# EAGLE design keyboard (EAGLE 9.6.2)
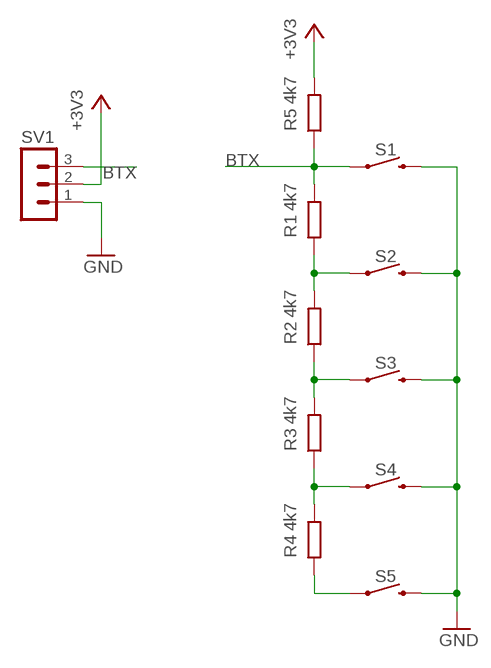
[diagram p0: schematic, sheet 1]

## Parts
R1  4k7  R-EU_R1206  [R1206]
R2  4k7  R-EU_R1206  [R1206]
R3  4k7  R-EU_R1206  [R1206]
R4  4k7  R-EU_R1206  [R1206]
R5  4k7  R-EU_R1206  [R1206]
S1  MOMENTARY-SWITCH-SPST-PTH-6.0MM  [TACTILE_SWITCH_PTH_6.0MM]
S2  MOMENTARY-SWITCH-SPST-PTH-6.0MM  [TACTILE_SWITCH_PTH_6.0MM]
S3  MOMENTARY-SWITCH-SPST-PTH-6.0MM  [TACTILE_SWITCH_PTH_6.0MM]
S4  MOMENTARY-SWITCH-SPST-PTH-6.0MM  [TACTILE_SWITCH_PTH_6.0MM]
S5  MOMENTARY-SWITCH-SPST-PTH-6.0MM  [TACTILE_SWITCH_PTH_6.0MM]
SV1  MA03-1  [MA03-1]

## Nets
+3V3 [VCC]: R5.2 SV1.2
BTX: R1.2 R5.1 S1.1 SV1.3
GND: S1.3 S2.3 S3.3 S4.3 S5.3 SV1.1
N$2: R3.1 R4.2 S4.1
N$3: R4.1 S5.1
N$5: R2.1 R3.2 S3.1
N$6: R1.1 R2.2 S2.1

## Library data of the parts
R1-R5 = resistor:R-EU_: RESISTOR, European symbol
S1-S5 = SparkFun-Switches:MOMENTARY-SWITCH-SPST: Momentary Switch (Pushbutton) - SPST Normally-open (NO) SPST momentary switches (buttons, pushbuttons). Variants PTH-12MM - 12mm square, through-hole Momentary Pushbutton Switch - 12mm Square <https://www.sparkfun.com/products/9190> (COM-09190) PTH-6.0MM, PTH-6.0MM-KIT - 6.0mm square, through-hole Mini Pushbutton Switch <https://www.sparkfun.com/products/97> (COM-00097) KIT package intended for soldering kit's - only one side of pads' copper is exposed. PTH-RIGHT-ANGLE-KIT - Right-angle, through-hole Right Angle Tactile Button <https://www.sparkfun.com/products/10791> - Used on SparkFun BigTime Watch Kit <https://www.sparkfun.com/products/11734> SMD-12MM - 12mm square, surface-mount Tactile Button - SMD (12mm) <https://www.sparkfun.com/products/12993> (COM-12993) Used on SparkFun PicoBoard <https://www.sparkfun.com/products/11888> SMD-4.5MM - 4.5mm Square Trackball Switch Used on SparkFun Blackberry Trackballer Breakout <https://www.sparkfun.com/products/13169> SMD-4.6MMX2.8MM - 4.60mm x 2.80mm, surface mount Used on SparkFun SAMD21 Mini Breakout <https://www.sparkfun.com/products/13664> SMD-5.2MM, SMD-5.2-REDUNDANT - 5.2mm square, surface-mount Mini Pushbutton Switch - SMD <https://www.sparkfun.com/products/8720> (COM-08720) Used on Arduino Pro Mini <https://www.sparkfun.com/products/11114> REDUNDANT package connects both switch circuits together SMD-6.0X3.5MM - 6.0 x 3.5mm, surface mount Momentary Reset Switch SMD <https://www.sparkfun.com/products/8229> (COM-08229) SMD-6.2MM-TALL - 6.2mm square, surface mount Tactile Button - SMD (6mm) <https://www.sparkfun.com/products/12992> Used on SparkFun Digital Sandbox <https://www.sparkfun.com/products/12651> SMD-RIGHT-ANGLE - Right-angle, surface mount Used on SparkFun Block for Intel® Edison - Arduino <https://www.sparkfun.com/products/13036>; PROD_ID: SWCH-08441; SF_SKU: COM-00097
SV1 = con-lstb:MA03-1: PIN HEADER; OC_FARNELL: unknown; OC_NEWARK: unknown

## Board
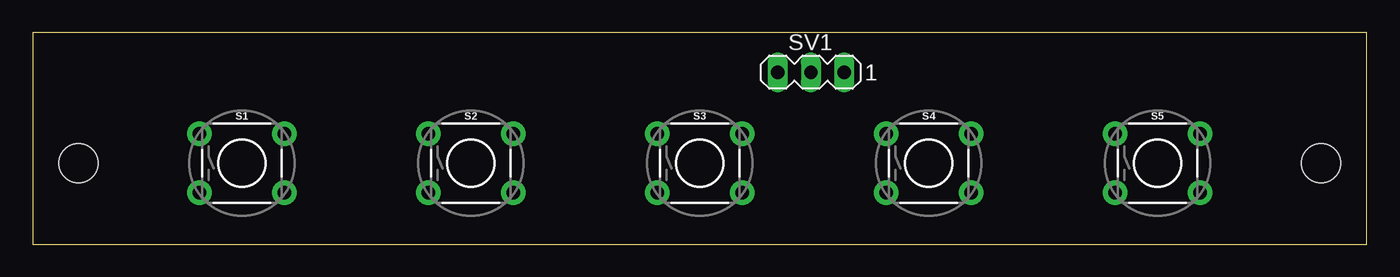
[diagram p1: board, top side]
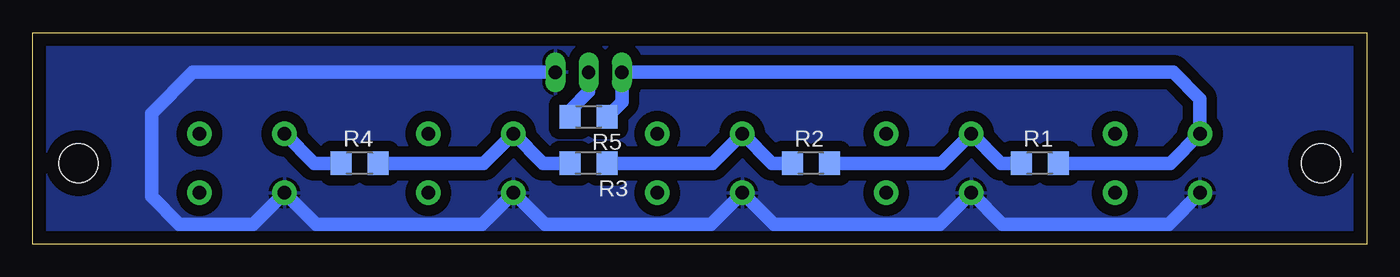
[diagram p2: board, bottom side, seen from below]

Size 102 x 16.19 mm. Coordinates in mm from the lower left corner, seen from the top.
Outline: 0,0 102,0 102,16.19 0,16.19 0,0
Copper layers (1*16): Top 0.035mm / dielectric 1.5mm / Bottom 0.035mm
Design rules "default": minimum track width 6mil, minimum drill 0.35mm, track to track 6mil, track to pad 6mil, pad to pad 6mil, via to via 6mil, smd to smd 6mil, copper to edge 40mil, drill to drill 6mil, minimum pad ring 10mil, minimum via ring 8mil, stop-mask expansion 4mil, vias tented up to drill 0mil, thermal gap 10mil
Holes 3 mm at 3.5,6.19 98.5,6.19

### Footprints (pad centres in the part's own frame; a part is rotated, then mirrored left to right if it is on the bottom)
R1206 = smd 1.6 x 1.803: 1 -1.422,0; 2 1.422,0
TACTILE_SWITCH_PTH_6.0MM = drill 1.016 pad 1.88: 1 -3.251,2.261; 2 3.251,2.261; 3 -3.251,-2.261; 4 3.251,-2.261
MA03-1 = drill 1.016 long: 1 -2.54,0; 2 0,0; 3 2.54,0

### Placement (x,y rotation side)
R1  25,6.19 0 bottom
R2  42.5,6.19 0 bottom
R3  59.5,6.19 0 bottom
R4  77,6.19 0 bottom
R5  59.5,9.75 180 bottom
S1  16,6.19 0 top
S2  33.5,6.19 0 top
S3  51,6.19 0 top
S4  68.5,6.19 0 top
S5  86,6.19 0 top
SV1  59.5,13.16 180 top

### Tracks (layer width: path | path; a pad name or v marks a point on that pad's centre or on a via)
+3V3
  Bottom 1.016: SV1.2 59.5,11.66 60.92,10.24 R5.2
BTX
  Bottom 1.016: R1.2 15.01,6.19 S1.1 12.75,11.12 14.79,13.16 SV1.3 56.96,10.86 R5.1
GND
  Bottom 1.016: S1.3 15.15,1.52 27.84,1.52 S2.3 32.65,1.52 45.34,1.52 S3.3 50.15,1.52 62.84,1.52 S4.3 67.65,1.52 80.34,1.52 S5.3 85.15,1.52 90.78,1.52 92.91,3.65 92.91,10 89.75,13.16 SV1.1
  pour Bottom (isolate 0.813): 0.2,16.35 101.8,16.35 101.8,-0.16 0.2,-0.16
N$2
  Bottom 1.016: R3.1 62.99,6.19 S4.1 67.51,6.19 R4.2
N$3
  Bottom 1.016: R4.1 80.49,6.19 S5.1
N$5
  Bottom 1.016: R2.1 45.49,6.19 S3.1 50.01,6.19 R3.2
N$6
  Bottom 1.016: R1.1 27.99,6.19 S2.1 32.51,6.19 R2.2